# EAGLE design 02A-007 (EAGLE 9.6.2)
Assembly variants: HIGHSPEED
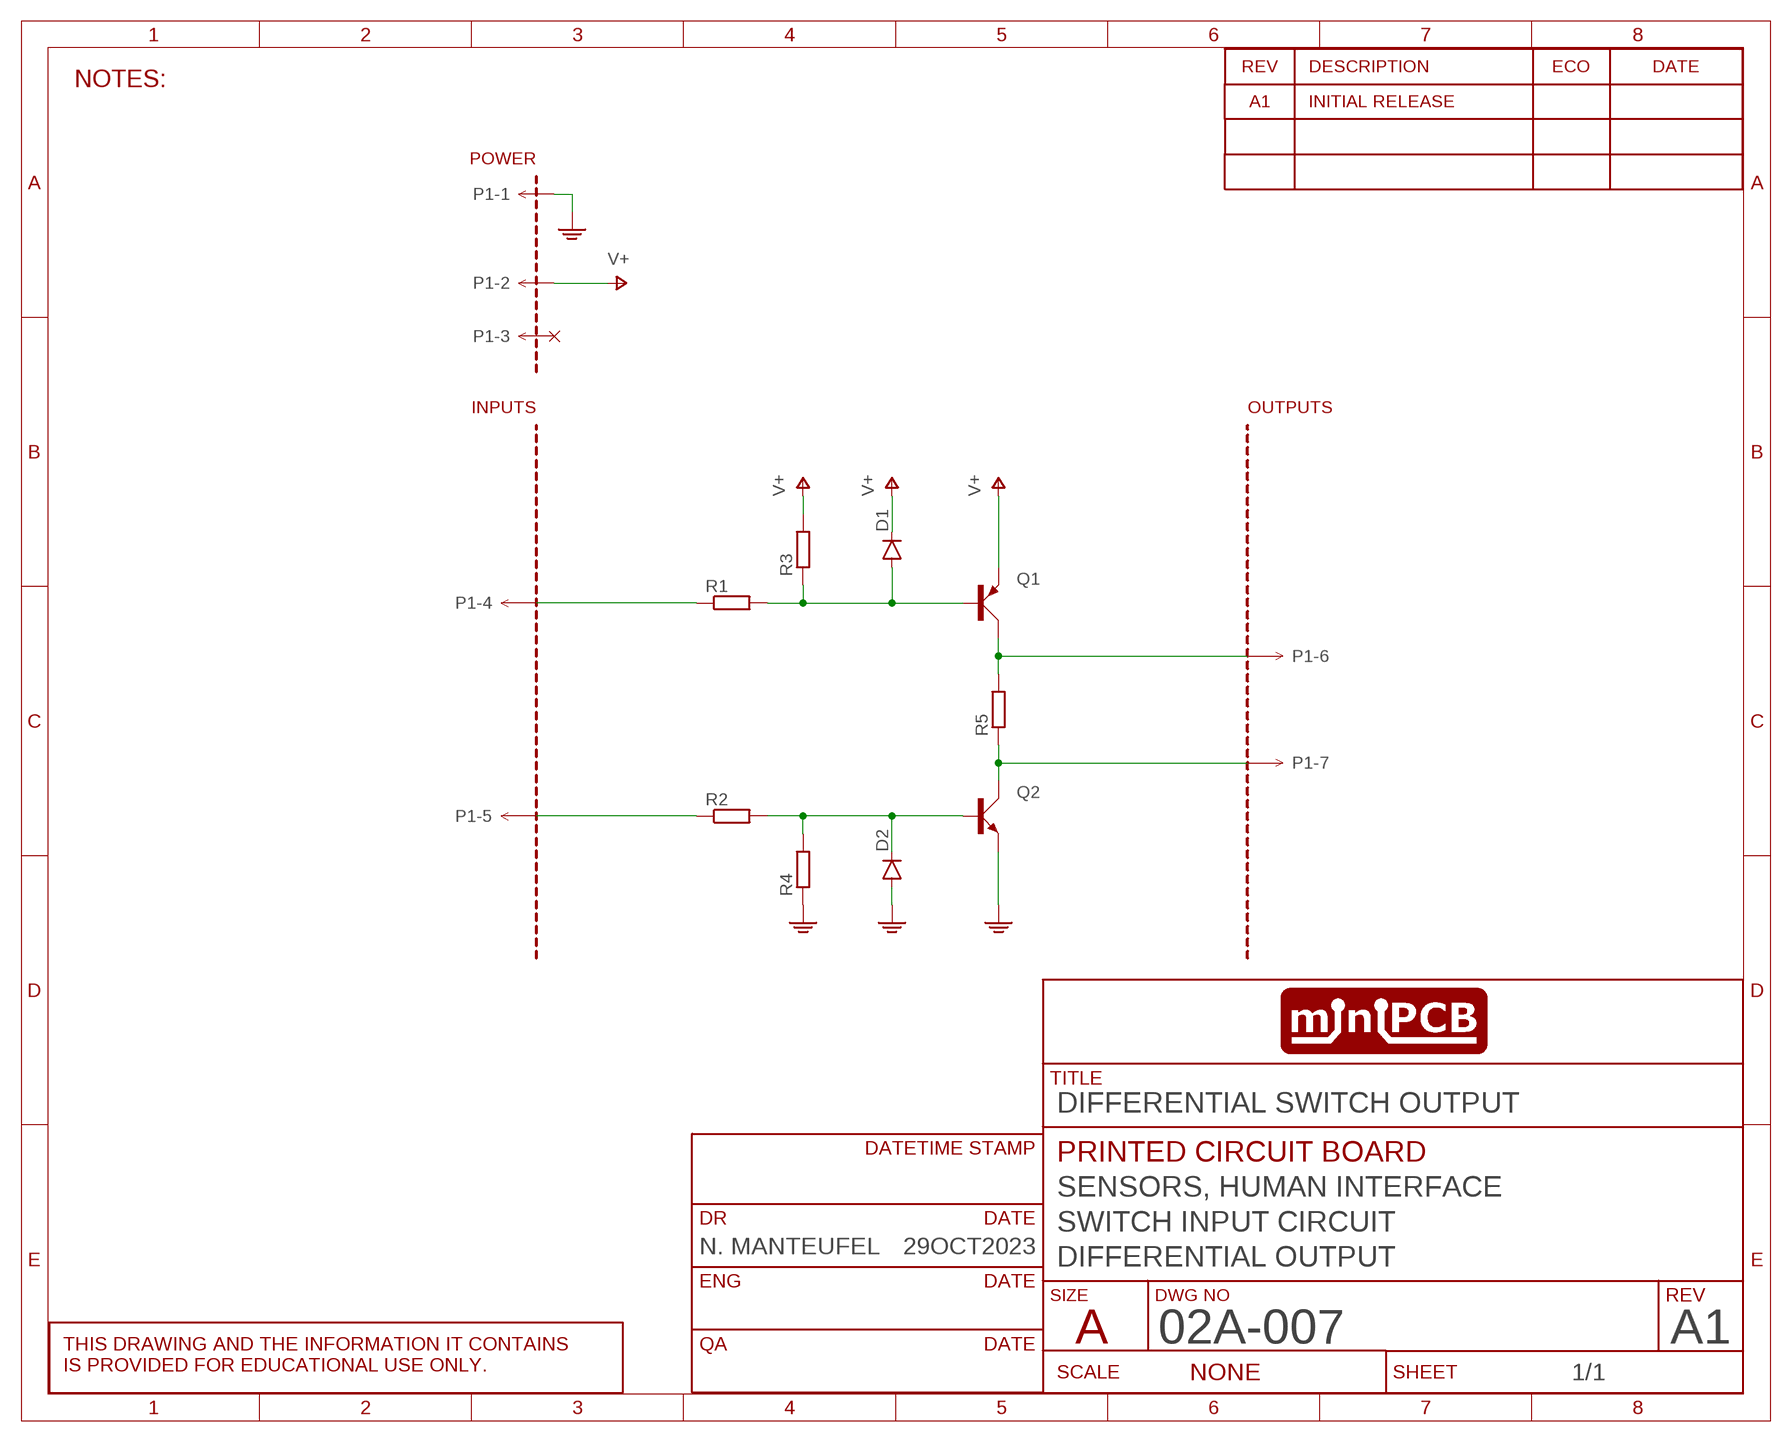
[diagram p0: schematic, sheet 1]
SHEET1 (SCHEMATIC): CIRCUIT_CATEGORY: SENSORS, HUMAN INTERFACE; CIRCUIT_NAME: SWITCH INPUT CIRCUIT; CIRCUIT_VARIANT: DIFFERENTIAL OUTPUT; DR: N. MANTEUFEL; DR_DATE: 29OCT2023; PCB_PCBA: PRINTED CIRCUIT BOARD; REVA: A1; REVISION: A1; TITLE: DIFFERENTIAL SWITCH OUTPUT

## Parts
D1  DIODESMD  [DO214AC]
D2  DIODESMD  [DO214AC]
P1  MINIPCB_7P  [PINS_1X7]
PCB1  MINIPCB_0P00A-20X25  [MINIPCB_00A_20X25]
Q1  BJT_PNPBEC  [SOT23]
Q2  BJT_NPNBEC  [SOT23]
R1  RESISTORSMD  [R0805]
R2  RESISTORSMD  [R0805]
R3  RESISTORSMD  [R0805]
R4  RESISTORSMD  [R0805]
R5  RESISTORSMD  [R0805]

## Nets
GND: D2.A P1.1 Q2.2(E) R4.1
INPUT: P1.4 R1.1
N$1: D1.A Q1.1(B) R1.2 R3.1
N$3: P1.7 Q2.3(C) R5.1
N$4: D2.C Q2.1(B) R2.2 R4.2
N$5: P1.6 Q1.3(C) R5.2
N$6: P1.5 R2.1
V+: D1.C P1.2 Q1.2(E) R3.2
Unconnected: P1.3

## Notes on the sheet
- NOTES:

## Library data of the parts
D1 D2 = minipcb:DIODE
P1 = minipcb:MINIPCB_7P
PCB1 = minipcb:MINIPCB_0P; CIRCUIT_CATEGORY: CIRCUIT CATEGORY; PART_NUMBER: 02A-007; REVISION: A1-01; TITLE: TITLE
Q1 = minipcb:BJT_PNP: TRANSISTOR
Q2 = minipcb:BJT_NPN: TRANSISTOR
R1-R5 = minipcb:RESISTOR

## Board
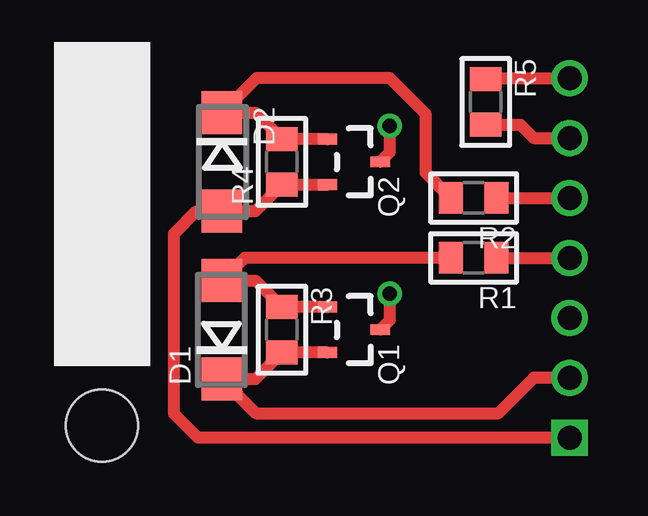
[diagram p1: board, top side]
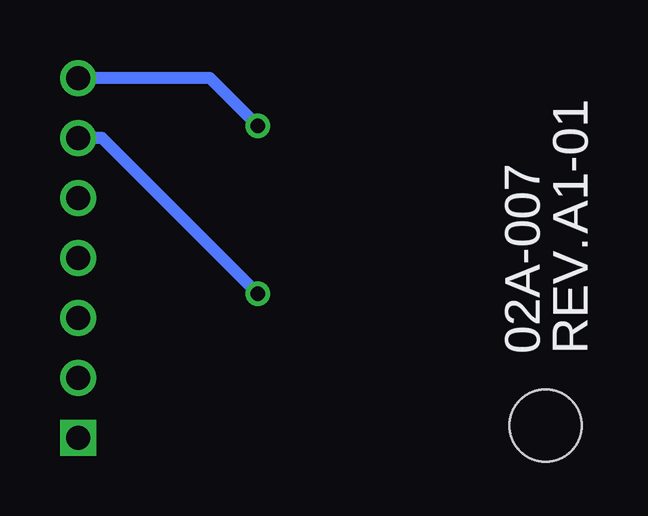
[diagram p2: board, bottom side, seen from below]

No outline drawn. Coordinates in mm, seen from the top.
Copper layers (1*16): Top 0.035mm / dielectric 1.5mm / Bottom 0.035mm
Design rules "default": minimum track width 10mil, minimum drill 24mil, track to track 8mil, track to pad 8mil, pad to pad 8mil, via to via 8mil, smd to smd 8mil, copper to edge 40mil, drill to drill 8mil, minimum pad ring 10mil, minimum via ring 8mil, stop-mask expansion 4mil, vias tented up to drill 0mil, thermal gap 10mil

### Footprints (pad centres in the part's own frame; a part is rotated, then mirrored left to right if it is on the bottom)
DO214AC = smd 1.8 x 1.7: A 2.05,0; C -2.05,0
PINS_1X7 = drill 1 square: 1 0,0 | drill 1: 2 2.5,0; 3 5,0; 4 7.5,0; 5 10,0; 6 12.5,0; 7 15,0
MINIPCB_00A_20X25 = hole 3: 3,3
SOT23 = smd 0.45 x 0.8: 1 -0.95,-1.1; 2 0.95,-1.1; 3 0,1.1
R0805 = smd 1 x 1.3: 1 -0.95,0; 2 0.95,0

### Placement (x,y rotation side)
D1  8,7 90 top
D2  8,14 270 top
P1  22.5,2.5 90 top
PCB1  0,0 0 top
Q1  13.5,7 270 top
Q2  13.5,14 270 top
R1  18.5,10 180 top
R2  18.5,12.5 180 top
R3  10.5,7 270 top
R4  10.5,14 90 top
R5  19,16.5 270 top

### Tracks (layer width: path | path; a pad name or v marks a point on that pad's centre or on a via)
GND
  Top 0.5: P1.1 7,2.5 6,3.5 6,11 6.95,11.95 D2.A 9.4,11.95 R4.1 Q2.2
INPUT
  Top 0.5: R1.1 P1.4
N$1
  Top 0.5: Q1.1 R3.1 9.4,9.05 D1.A 8.95,10 R1.2
N$3  (via drill 0.61)
  Top 0.5: Q2.3 15,14.4 v15,15.5 | R5.1 19.05,17.5 P1.7
  Bottom 0.5: v15,15.5 17,17.5 P1.7
N$4
  Top 0.5: Q2.1 R4.2 9.4,16.05 D2.C 9.45,17.5 15,17.5 16.5,16 16.5,13.55 R2.2
N$5  (via drill 0.61)
  Top 0.5: R5.2 20.45,15.55 21,15 P1.6 | Q1.3 15,7.4 v15,8.5
  Bottom 0.5: v15,8.5 21.5,15 P1.6
N$6
  Top 0.5: R2.1 P1.5
V+
  Top 0.5: P1.2 21,5 19.5,3.5 9.45,3.5 D1.C 9.4,4.95 R3.2 Q1.2